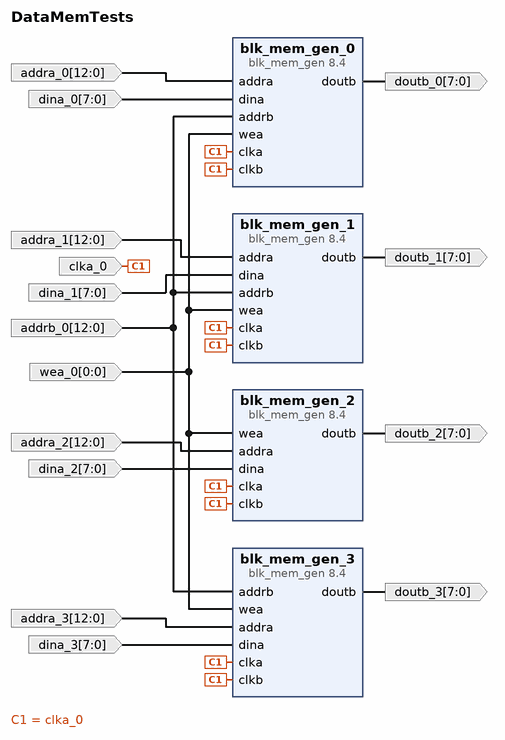
[diagram p0: block diagram of the top level]
# Vivado block design DataMemTests, xc7z010clg400-1, Vivado 2023.1
create_bd_design DataMemTests

create_bd_port -dir I -type clk clka_0
create_bd_port -dir I -from 7 -to 0 dina_0
create_bd_port -dir O -from 7 -to 0 doutb_0
create_bd_port -dir I -from 12 -to 0 addrb_0
create_bd_port -dir I -from 7 -to 0 dina_1
create_bd_port -dir O -from 7 -to 0 doutb_1
create_bd_port -dir I -from 7 -to 0 dina_2
create_bd_port -dir O -from 7 -to 0 doutb_2
create_bd_port -dir I -from 7 -to 0 dina_3
create_bd_port -dir O -from 7 -to 0 doutb_3
create_bd_port -dir I -from 0 -to 0 wea_0
create_bd_port -dir I -from 12 -to 0 addra_0
create_bd_port -dir I -from 12 -to 0 addra_1
create_bd_port -dir I -from 12 -to 0 addra_2
create_bd_port -dir I -from 12 -to 0 addra_3

create_bd_cell -type ip -vlnv xilinx.com:ip:blk_mem_gen:8.4 blk_mem_gen_0
set_property -dict [list \
  CONFIG.Enable_32bit_Address false \
  CONFIG.Enable_A Always_Enabled \
  CONFIG.Enable_B Always_Enabled \
  CONFIG.Memory_Type Simple_Dual_Port_RAM \
  CONFIG.Register_PortB_Output_of_Memory_Primitives false \
  CONFIG.Write_Width_A 8 \
  CONFIG.use_bram_block Stand_Alone \
] [get_bd_cells blk_mem_gen_0]
create_bd_cell -type ip -vlnv xilinx.com:ip:blk_mem_gen:8.4 blk_mem_gen_1
set_property -dict [list \
  CONFIG.Enable_32bit_Address false \
  CONFIG.Enable_A Always_Enabled \
  CONFIG.Enable_B Always_Enabled \
  CONFIG.Memory_Type Simple_Dual_Port_RAM \
  CONFIG.Register_PortB_Output_of_Memory_Primitives false \
  CONFIG.Write_Width_A 8 \
  CONFIG.use_bram_block Stand_Alone \
] [get_bd_cells blk_mem_gen_1]
create_bd_cell -type ip -vlnv xilinx.com:ip:blk_mem_gen:8.4 blk_mem_gen_2
set_property -dict [list \
  CONFIG.Enable_32bit_Address false \
  CONFIG.Enable_A Always_Enabled \
  CONFIG.Enable_B Always_Enabled \
  CONFIG.Memory_Type Simple_Dual_Port_RAM \
  CONFIG.Register_PortB_Output_of_Memory_Primitives false \
  CONFIG.Write_Width_A 8 \
  CONFIG.use_bram_block Stand_Alone \
] [get_bd_cells blk_mem_gen_2]
create_bd_cell -type ip -vlnv xilinx.com:ip:blk_mem_gen:8.4 blk_mem_gen_3
set_property -dict [list \
  CONFIG.Enable_32bit_Address false \
  CONFIG.Enable_A Always_Enabled \
  CONFIG.Enable_B Always_Enabled \
  CONFIG.Memory_Type Simple_Dual_Port_RAM \
  CONFIG.Register_PortB_Output_of_Memory_Primitives false \
  CONFIG.Write_Width_A 8 \
  CONFIG.use_bram_block Stand_Alone \
] [get_bd_cells blk_mem_gen_3]

# ---- connections ----

connect_bd_net -net addra_0_1 [get_bd_ports addra_0] [get_bd_pins blk_mem_gen_0/addra]
connect_bd_net -net addra_1_1 [get_bd_ports addra_1] [get_bd_pins blk_mem_gen_1/addra]
connect_bd_net -net addra_2_1 [get_bd_ports addra_2] [get_bd_pins blk_mem_gen_2/addra]
connect_bd_net -net addra_3_1 [get_bd_ports addra_3] [get_bd_pins blk_mem_gen_3/addra]
connect_bd_net -net addrb_0_1 [get_bd_ports addrb_0] \
  [get_bd_pins blk_mem_gen_0/addrb] [get_bd_pins blk_mem_gen_1/addrb] [get_bd_pins blk_mem_gen_3/addrb]
connect_bd_net [get_bd_pins blk_mem_gen_0/doutb] [get_bd_ports doutb_0]
connect_bd_net [get_bd_pins blk_mem_gen_1/doutb] [get_bd_ports doutb_1]
connect_bd_net [get_bd_pins blk_mem_gen_2/doutb] [get_bd_ports doutb_2]
connect_bd_net [get_bd_pins blk_mem_gen_3/doutb] [get_bd_ports doutb_3]
connect_bd_net -net clka_0_1 [get_bd_ports clka_0] \
  [get_bd_pins blk_mem_gen_0/clka] [get_bd_pins blk_mem_gen_0/clkb] [get_bd_pins blk_mem_gen_1/clka] \
  [get_bd_pins blk_mem_gen_1/clkb] [get_bd_pins blk_mem_gen_2/clka] [get_bd_pins blk_mem_gen_2/clkb] \
  [get_bd_pins blk_mem_gen_3/clka] [get_bd_pins blk_mem_gen_3/clkb]
connect_bd_net -net dina_0_1 [get_bd_ports dina_0] [get_bd_pins blk_mem_gen_0/dina]
connect_bd_net -net dina_1_1 [get_bd_ports dina_1] [get_bd_pins blk_mem_gen_1/dina]
connect_bd_net -net dina_2_1 [get_bd_ports dina_2] [get_bd_pins blk_mem_gen_2/dina]
connect_bd_net -net dina_3_1 [get_bd_ports dina_3] [get_bd_pins blk_mem_gen_3/dina]
connect_bd_net -net wea_0_1 [get_bd_ports wea_0] \
  [get_bd_pins blk_mem_gen_0/wea] [get_bd_pins blk_mem_gen_1/wea] [get_bd_pins blk_mem_gen_2/wea] \
  [get_bd_pins blk_mem_gen_3/wea]

validate_bd_design
save_bd_design
